# EAGLE board AllOfTheAbove7x14novTRIMS (EAGLE 9.5.1), part 1 of 2
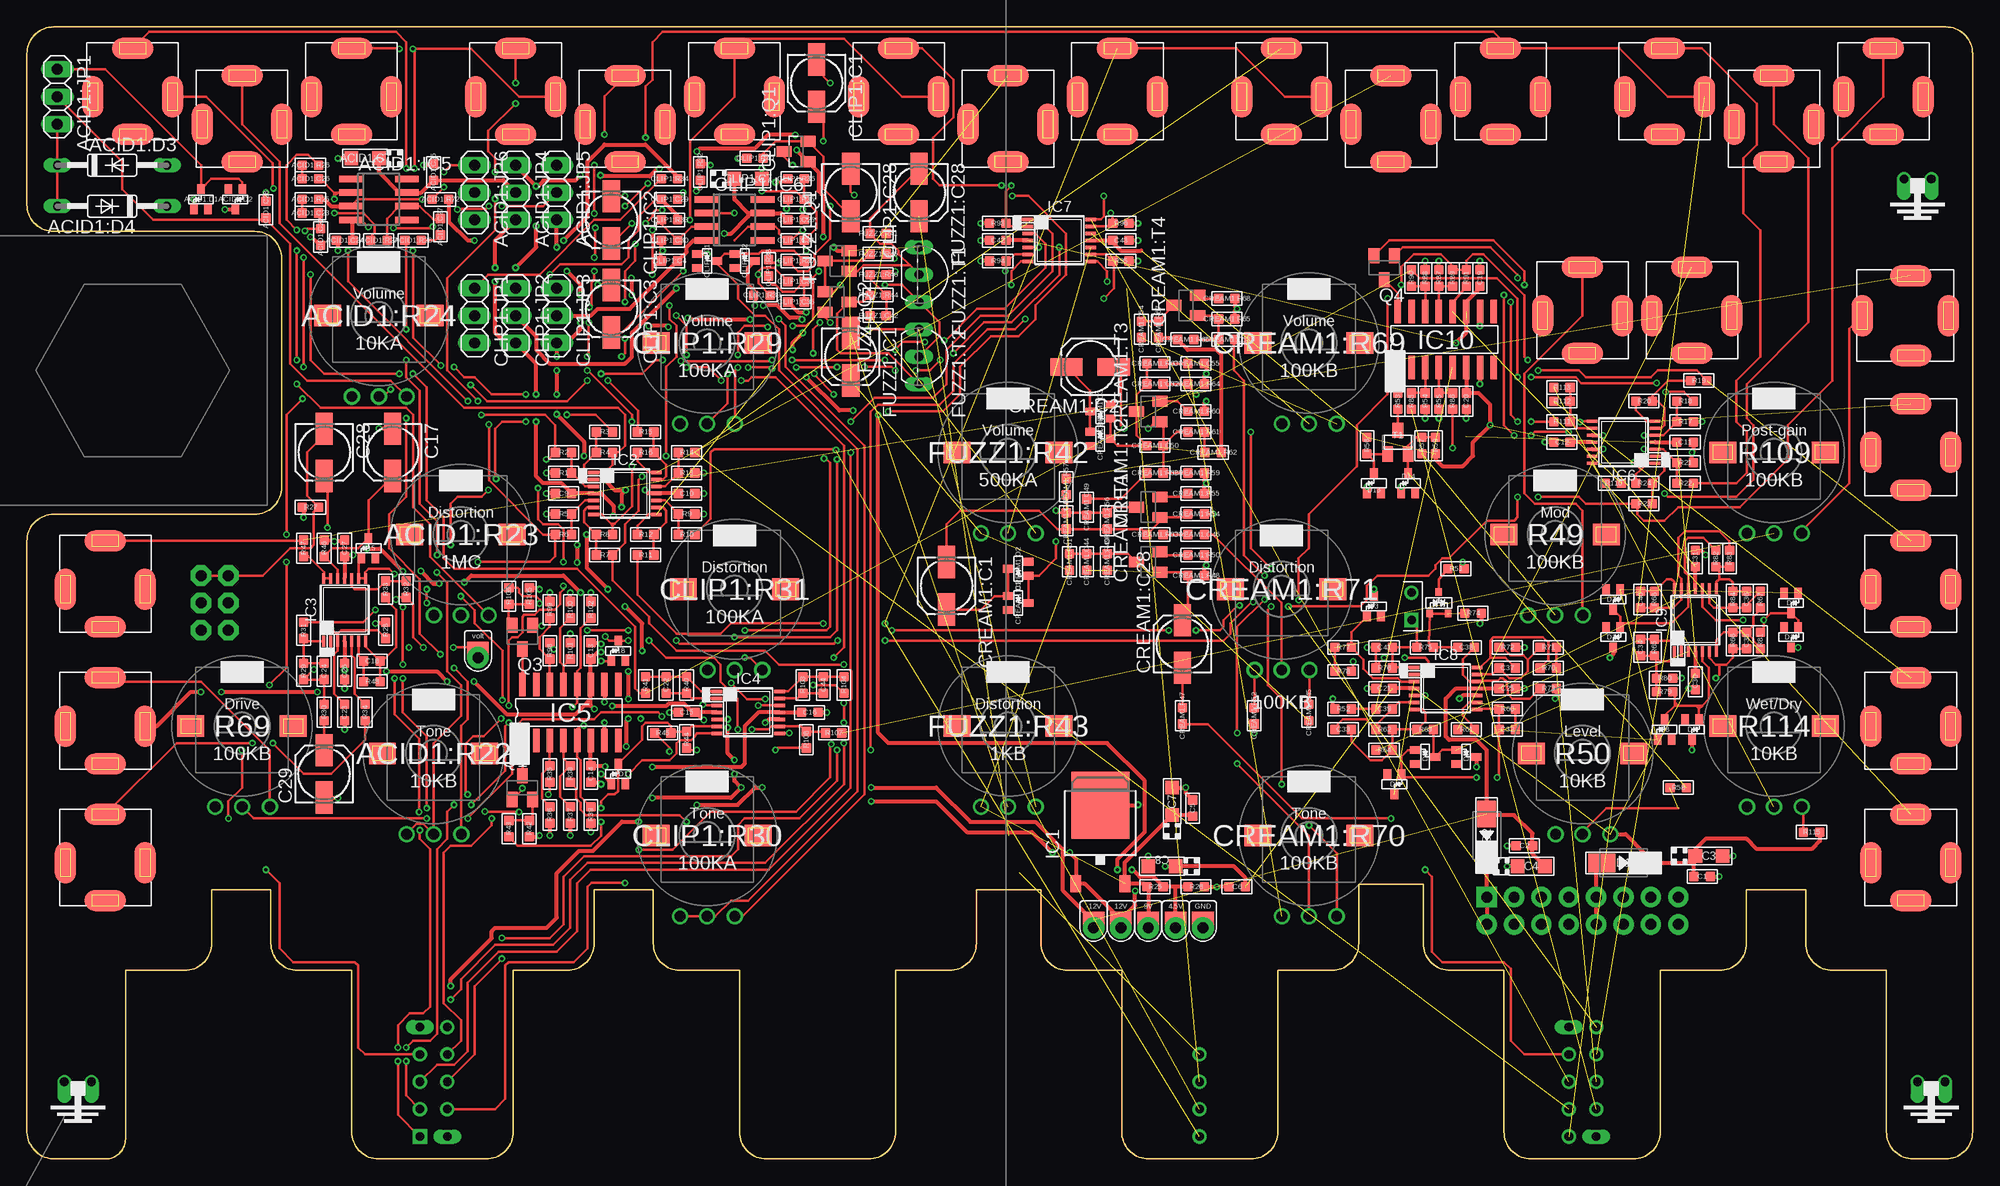
[diagram p10: board, top side]
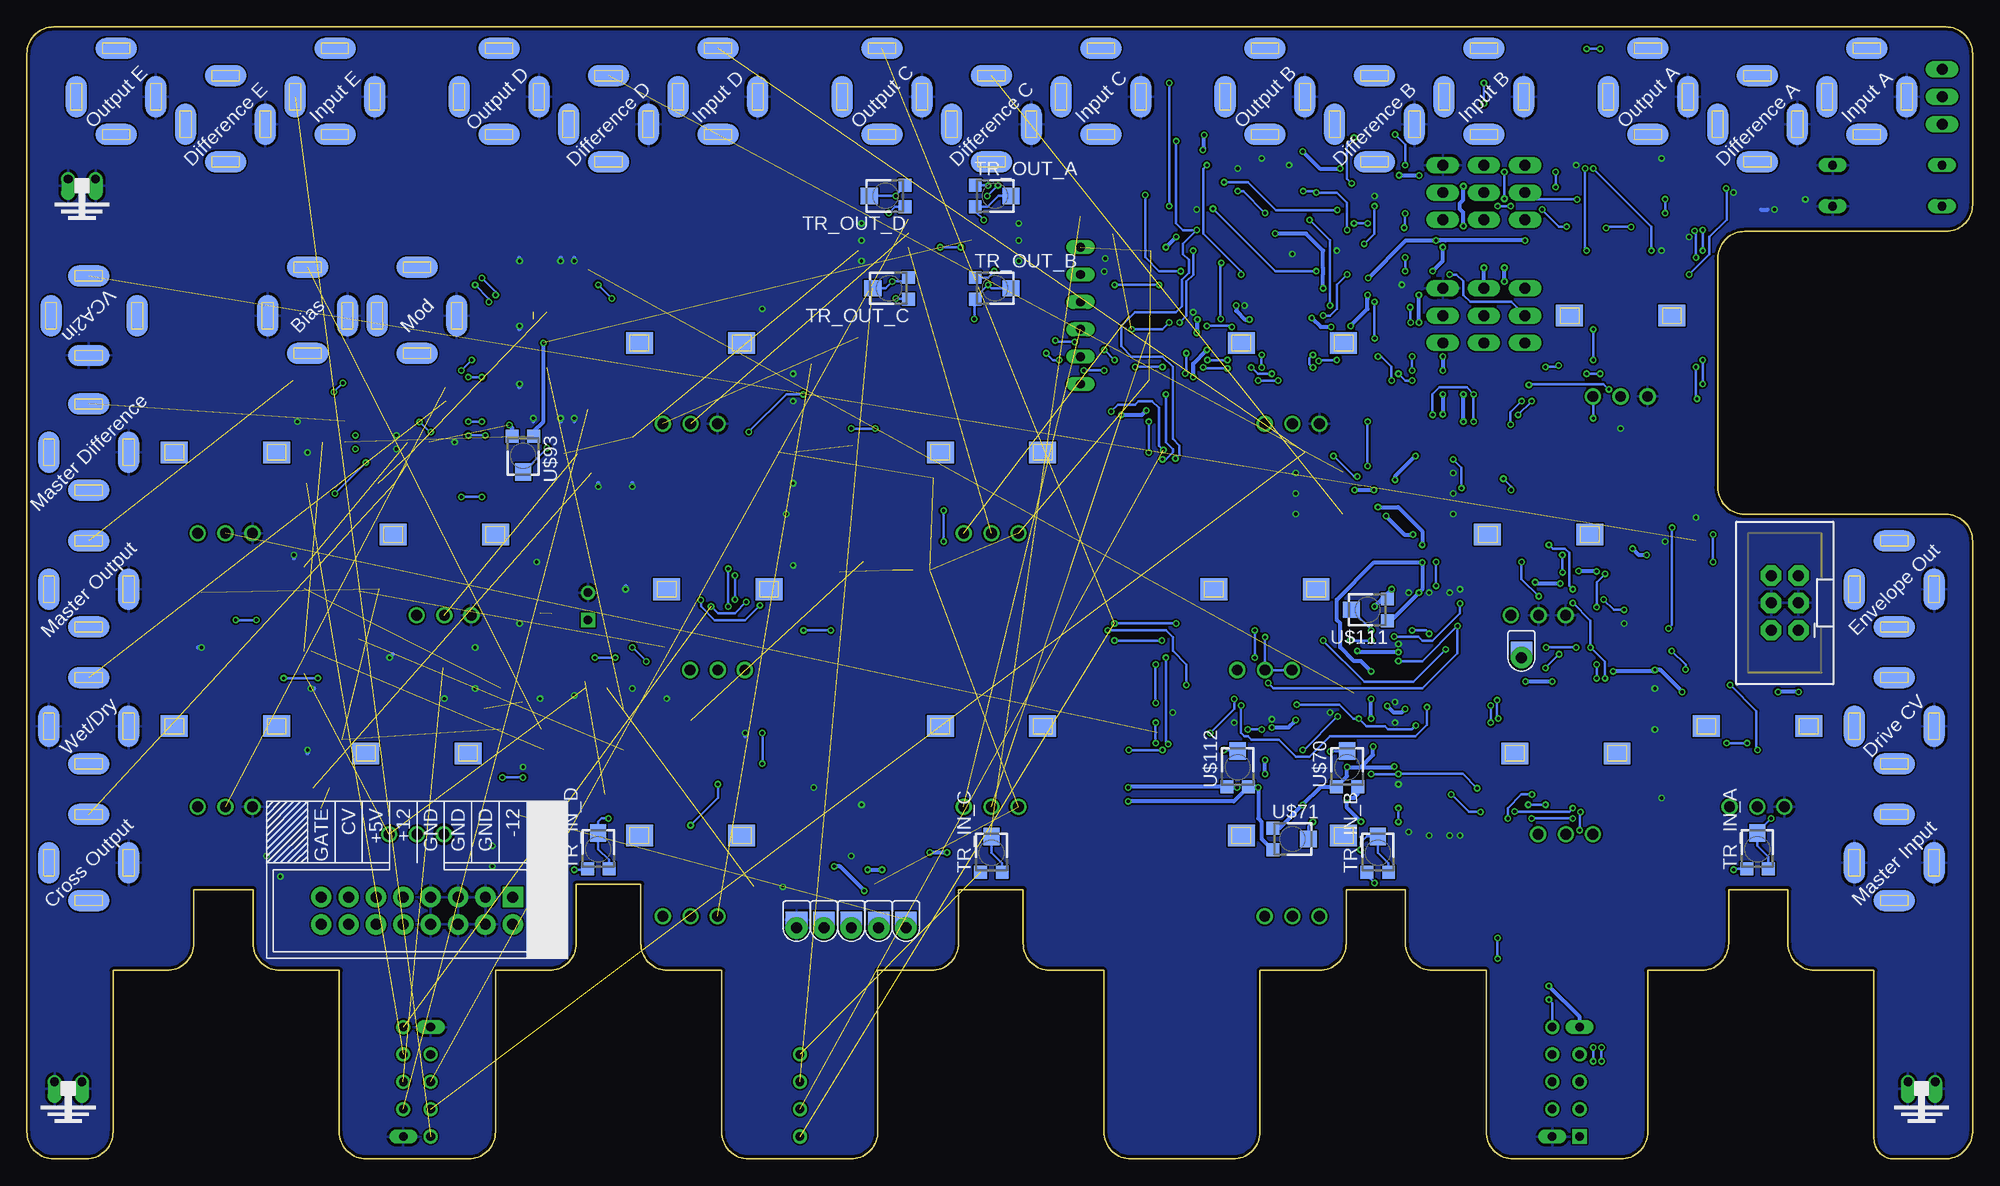
[diagram p11: board, bottom side, seen from below]

Size 180.66 x 105.08 mm. Coordinates in mm from the lower left corner, seen from the top.
Copper layers (1*16): Top 0.035mm / dielectric 1.5mm / Bottom 0.035mm
Design rules "ITeadstudio": minimum track width 6mil, minimum drill 12mil, track to track 6mil, track to pad 6mil, pad to pad 6mil, via to via 6mil, smd to smd 0mil, copper to edge 10mil, drill to drill 10mil, minimum pad ring 10mil, minimum via ring 6mil, stop-mask expansion 2mil, vias tented up to drill 100mil, thermal gap 10mil
Net classes: 0 default: width 0.254 mm; 1 power: width 0.381 mm

## Footprints (pad centres in the part's own frame; a part is rotated, then mirrored left to right if it is on the bottom)
CASE-A_3216 = smd 1.27 x 1.27: + -1.27,0; - 1.27,0
C0603 = smd 0.889 x 0.889: 1 -0.762,0; 2 0.762,0
SOT-323 = smd 0.7 x 0.9: ANODE -0.65,-0.95; CATHODE 0,0.95; NC 0.65,-0.95
DO35-10 = drill 0.813 long: A 5.08,0; C -5.08,0
SO08 = smd 0.6 x 2.2: 1 -1.905,-2.6; 2 -0.635,-2.6; 3 0.635,-2.6; 4 1.905,-2.6; 5 1.905,2.6; 6 0.635,2.6; 7 -0.635,2.6; 8 -1.905,2.6
1X03 = drill 1.016 long: 1 -2.54,0; 2 0,0; 3 2.54,0
ALPS_POT_SQUAREHOLES = drill 1: P$1 -2.5,-7.5; P$2 0,-7.5; P$3 2.58,-7.5 | smd 2.5 x 2: P$4 -4.75,0; P$5 4.75,0 | smd 2.5 x 2 bottom: P$6 -4.75,0; P$7 4.75,0
R0603 = smd 0.889 x 0.889: 1 -0.762,0; 2 0.762,0
153CLV-0505 = smd 3 x 1.6: + 2.2,0; - -2.2,0
SOT23 = smd 1 x 1.4: 1 -0.95,-1.1; 2 0.95,-1.1; 3 0,1.1
SOT23-BEC = smd 1 x 1.4: B -0.95,-1.1; C 0,1.1; E 0.95,-1.1
DO-214AC = smd 2.5 x 1.7: 1 -2,0; 2 2,0
TO92-EBC = drill 0.813 long: B 0,-1.27; C 2.54,-1.27; E -2.54,-1.27
TO252 = smd 1 x 1.6: 1 -2.28,-4.8; 2 2.28,-4.8 | smd 5.4 x 6.2: 3 0,2.5
TSSOP14 = smd 0.305 x 0.991: 1 -1.95,-2.918; 2 -1.3,-2.918; 3 -0.65,-2.918; 4 0,-2.918; 5 0.65,-2.918; 6 1.3,-2.918; 7 1.95,-2.918; 8 1.95,2.918; 9 1.3,2.918; 10 0.65,2.918; 11 0,2.918; 12 -0.65,2.918; 13 -1.3,2.918; 14 -1.95,2.918
SO16 = smd 0.6 x 2.2: 1 -4.445,-2.6; 2 -3.175,-2.6; 3 -1.905,-2.6; 4 -0.635,-2.6; 5 0.635,-2.6; 6 1.905,-2.6; 7 3.175,-2.6; 8 4.445,-2.6; 9 4.445,2.6; 10 3.175,2.6; 11 1.905,2.6; 12 0.635,2.6; 13 -0.635,2.6; 14 -1.905,2.6; 15 -3.175,2.6; 16 -4.445,2.6
3.5MM-JACK-SWITCH-13MM-NOHOLES = smd 1.95 x 3.85 bottom: RING_B@1 -3.7,0; SWITCH_B@1 3.7,0 | smd 1.95 x 3.85: RING_T@3 -3.7,0; SWITCH_T@3 3.7,0 | smd 3.85 x 1.95 bottom: SECOND_B@1 0,-3.5; TIP_B@1 0,4.5 | smd 3.85 x 1.95: SECOND_T@3 0,-3.5; TIP_T@3 0,4.5
POWER_16_SHROUDED = drill 1.016 pad 1.88 square: 1 -8.89,-1.27 | drill 1.016 pad 1.88: 2 -8.89,1.27; 3 -6.35,-1.27; 4 -6.35,1.27; 5 -3.81,-1.27; 6 -3.81,1.27; 7 -1.27,-1.27; 8 -1.27,1.27; 9 1.27,-1.27; 10 1.27,1.27; 11 3.81,-1.27; 12 3.81,1.27; 13 6.35,-1.27; 14 6.35,1.27; 15 8.89,-1.27; 16 8.89,1.27
TC33X = smd 1.2 x 1.2: 1 -1,-1.825; 3 1,-1.825 | smd 1.5 x 1.6: 2 0,1.5
POWERTESTPAD = drill 1 pad 2: P$1 0,0 | smd 2 x 1.5: P$2 0,-0.75 | smd 2 x 1.5 bottom: P$3 0,-0.75
BYPASSBOARD = drill 0.8 long: 12V 31.75,15.24; GND 34.29,5.08; GND2 138.43,15.24; GND3 140.97,5.08 | drill 0.8 square: P$1 31.75,5.08 | drill 0.8: P$2 31.75,10.16; P$3 31.75,7.62; P$4 31.75,12.7; P$5 34.29,15.24; P$6 34.29,10.16; P$7 34.29,12.7; P$8 34.29,7.62; P$9 104.14,5.08; P$10 104.14,10.16; P$11 104.14,7.62; P$12 104.14,12.7; P$13 138.43,5.08; P$14 138.43,10.16; P$15 138.43,7.62; P$16 138.43,12.7; P$17 140.97,15.24; P$18 140.97,10.16; P$19 140.97,12.7; P$20 140.97,7.62
GROUNDLOOP = drill 0.8 offset: P$1 1.27,0; P$2 -1.27,0
2X3-SHROUDED = drill 1.016 pad 1.88 octagon: 1 -1.27,2.54; 2 1.27,2.54; 3 -1.27,0; 4 1.27,0; 5 -1.27,-2.54; 6 1.27,-2.54
SOT23' = smd 0.6 x 0.7: P$1 -0.85,-1; P$2 0.85,-1; P$3 0,1
TESTPAD_DUAL_PTH = drill 0.8 square: P$1 -1.27,0 | drill 0.8: P$2 1.27,0

## Placement (x,y rotation side)
ACID1:C7  10uF  [CASE-A_3216]  31.41,92.89 180 top
ACID1:C22  1nF  [C0603]  27.28,85.58 270 top
ACID1:C23  10nF  [C0603]  26.33,87.81 180 top
ACID1:C24  100n  [C0603]  29.5,85.27 180 top
ACID1:C25  100n  [C0603]  37.76,91.61 90 top
ACID1:C26  47nF  [C0603]  26.33,90.98 0 top
ACID1:C27  1uF  [C0603]  38.39,86.53 270 top
ACID1:C28  1nF  [C0603]  22.2,88.12 270 top
ACID1:D1  BAS16W  [SOT-323]  16.17,89.08 0 top
ACID1:D2  BAS16W  [SOT-323]  19.34,89.08 180 top
ACID1:D3  1N4148DO35-10  [DO35-10]  7.91,92.25 0 top
ACID1:D4  1N4148DO35-10  [DO35-10]  7.91,88.44 180 top
ACID1:IC5  UA741D  [SO08]  32.68,89.08 270 top
ACID1:JP1  GERMANIUMSELECTOR  [1X03]  2.83,98.6 270 top
ACID1:JP4  ACID+  [1X03]  45.38,89.71 270 top
ACID1:JP5  ACID-  [1X03]  49.19,89.71 270 top
ACID1:JP6  ACIDBIAS  [1X03]  41.57,89.71 270 top
ACID1:R22  10KB  [ALPS_POT_SQUAREHOLES]  37.76,37.64 0 top
ACID1:R23  1MC  [ALPS_POT_SQUAREHOLES]  40.3,57.96 0 top
ACID1:R24  10KA  [ALPS_POT_SQUAREHOLES]  32.68,78.28 0 top
ACID1:R25  10K  [R0603]  26.33,89.08 180 top
ACID1:R26  4.7K  [R0603]  26.33,92.25 0 top
ACID1:R27  1M  [R0603]  32.68,85.27 0 top
ACID1:R28  5.6K  [R0603]  35.85,85.27 0 top
ACID1:R72  1M  [R0603]  38.39,89.08 0 top
C1  100n  [C0603]  155.55,26.21 180 top
C2  100n  [C0603]  139.04,29.07 180 top
C3  10u  [CASE-A_3216]  156.18,28.11 0 top
C4  10u  [CASE-A_3216]  139.67,27.16 0 top
C5  100n  [C0603]  108.24,32.56 270 top
C6  100n  [C0603]  112.37,25.26 0 top
C7  10u  [CASE-A_3216]  106.34,33.2 90 top
C8  10u  [CASE-A_3216]  105.38,27.16 180 top
C9  100n  [C0603]  49.82,61.77 0 top
C10  100n  [C0603]  61.25,61.77 0 top
C11  100n  [C0603]  153.96,66.53 180 top
C12  100n  [C0603]  142.53,66.53 180 top
C13  100n  [C0603]  52.36,47.16 270 top
C14  100n  [C0603]  52.36,35.73 270 top
C15  100n  [C0603]  61.25,41.45 0 top
C16  100n  [C0603]  72.68,41.45 0 top
C17  10uF  [153CLV-0505]  33.95,65.58 270 top
C18  10pF  [C0603]  32.04,46.21 0 top
C19  100n  [C0603]  134.91,81.77 270 top
C20  100n  [C0603]  133.64,70.34 270 top
C21  100n  [C0603]  126.02,43.67 0 top
C22  10pF  [C0603]  59.35,43.99 90 top
C23  10pF  [C0603]  29.5,41.45 90 top
C24  47pF  [C0603]  27.6,45.26 270 top
C25  100n  [C0603]  137.45,43.67 0 top
C26  100n  [C0603]  29.5,45.26 90 top
C27  100n  [C0603]  29.5,56.69 90 top
C28  10uF  [153CLV-0505]  27.6,65.58 270 top
C29  10uF  [153CLV-0505]  27.6,35.73 90 top
C30  100n  [C0603]  154.91,44.31 90 top
C31  100n  [C0603]  154.91,55.74 90 top
C32  33p  [C0603]  137.45,39.86 0 top
C33  220p  [C0603]  122.21,39.86 180 top
C34  33p  [C0603]  149.83,47.48 90 top
C35  33p  [C0603]  159.68,48.12 270 top
C36  33p  [C0603]  159.68,51.93 270 top
C37  33p  [C0603]  137.45,45.58 180 top
C38  100n  [C0603]  133.64,47.48 180 top
C39  680n  [C0603]  126.02,41.77 0 top
C40  33p FIX  [C0603]  149.83,51.93 270 top
C41  33p FIX  [C0603]  126.02,47.48 180 top
C42  100n  [C0603]  90.14,85.27 0 top
C43  100n  [C0603]  101.57,85.27 0 top
C44  10pF  [C0603]  73.95,43.99 90 top
CLIP1:C1  4.7uF  [153CLV-0505]  73.32,99.87 270 top
CLIP1:C2  2.2uF  [153CLV-0505]  54.27,87.17 270 top
CLIP1:C3  4.7uF  [153CLV-0505]  54.27,78.92 270 top
CLIP1:C4  100n  [C0603]  59.66,83.36 180 top
CLIP1:C7  10uF  [CASE-A_3216]  66.97,90.98 0 top
CLIP1:C25  100n  [C0603]  71.41,87.17 0 top
CLIP1:C28  1uF  [153CLV-0505]  76.49,89.71 270 top
CLIP1:C29  22nF  [C0603]  59.66,89.08 180 top
CLIP1:C30  1nF  [C0603]  59.66,85.27 0 top
CLIP1:C31  100pF  [C0603]  71.41,85.27 180 top
CLIP1:C35  3.3nF  [C0603]  71.41,79.55 180 top
CLIP1:C36  22nF  [C0603]  71.41,81.45 180 top
CLIP1:D1  BAS16W  [SOT-323]  63.16,83.36 270 top
CLIP1:D2  BAS16W  [SOT-323]  66.65,83.36 270 top
CLIP1:IC6  UA741D  [SO08]  65.7,87.17 270 top
CLIP1:JP1  CLIPBIAS  [1X03]  41.57,78.28 270 top
CLIP1:JP2  CLIP+  [1X03]  45.38,78.28 270 top
CLIP1:JP3  CLIP-  [1X03]  49.19,78.28 270 top
CLIP1:Q1  SST201  [SOT23]  71.41,93.52 90 top
CLIP1:R29  100KA  [ALPS_POT_SQUAREHOLES]  63.16,75.74 0 top
CLIP1:R30  100KA  [ALPS_POT_SQUAREHOLES]  63.16,30.02 0 top
CLIP1:R31  100KA  [ALPS_POT_SQUAREHOLES]  65.7,52.88 0 top
CLIP1:R32  1M  [R0603]  62.52,91.61 90 top
CLIP1:R33  1K  [R0603]  59.66,87.17 180 top
CLIP1:R34  1M  [R0603]  59.66,90.98 0 top
CLIP1:R35  560R  [R0603]  71.41,89.08 0 top
CLIP1:R36  47R  [R0603]  71.41,90.98 0 top
CLIP1:R37  1K  [R0603]  71.41,83.36 0 top
CLIP1:R38  1.5K  [R0603]  68.87,82.72 270 top
CLIP1:R39  1M  [R0603]  68.24,80.19 0 top
CLIP1:R40  10K  [R0603]  67.6,92.89 0 top
CREAM1:C1  1uF  [153CLV-0505]  85.38,53.2 270 top
CREAM1:C2  1uF  [153CLV-0505]  98.72,73.52 180 top
CREAM1:C28  1uF  [153CLV-0505]  107.29,47.8 90 top
CREAM1:C44  470pF  [C0603]  98.4,55.42 90 top
CREAM1:C45  1uF  [C0603]  119.04,41.45 90 top
CREAM1:C46  100nF  [C0603]  108.56,57.96 180 top
CREAM1:C47  470pF  [C0603]  96.49,59.23 90 top
CREAM1:C49  100nF  [C0603]  98.4,60.5 90 top
CREAM1:C50  470pF  [C0603]  104.75,66.22 180 top
CREAM1:C52  4nF  [C0603]  104.75,71.93 0 top
CREAM1:C53  100nF  [C0603]  111.42,76.06 180 top
CREAM1:C54  100nF  [C0603]  103.48,77.01 270 top
CREAM1:C55  10nF  [C0603]  108.56,73.83 180 top
CREAM1:D1  BAS16W  [SOT-323]  92.05,51.61 270 top
CREAM1:D2  BAS16W  [SOT-323]  92.05,54.78 90 top
CREAM1:D3  BAS16W  [SOT-323]  99.67,69.39 90 top
CREAM1:D4  BAS16W  [SOT-323]  99.67,66.85 270 top
CREAM1:R47  39K  [R0603]  107.29,41.13 90 top
CREAM1:R48  47K  [R0603]  108.56,54.15 180 top
CREAM1:R49  470K  [R0603]  100.3,55.42 270 top
CREAM1:R50  100R  [R0603]  108.56,56.05 0 top
CREAM1:R51  10K  [R0603]  96.81,55.42 90 top
CREAM1:R52  1K  [R0603]  113.96,41.13 270 top
CREAM1:R53  10K  [R0603]  104.75,57.96 180 top
CREAM1:R54  100K  [R0603]  108.56,59.87 180 top
CREAM1:R55  150R  [R0603]  108.56,61.77 180 top
CREAM1:R56  470K  [R0603]  100.3,59.23 270 top
CREAM1:R57  10K  [R0603]  96.49,62.41 270 top
CREAM1:R58  10K  [R0603]  104.75,63.67 0 top
CREAM1:R59  100K  [R0603]  108.56,63.67 180 top
CREAM1:R60  150R  [R0603]  108.56,69.39 180 top
CREAM1:R61  470K  [R0603]  108.56,67.48 180 top
CREAM1:R62  10K  [R0603]  110.15,65.58 180 top
CREAM1:R63  39K  [R0603]  104.75,73.83 0 top
CREAM1:R64  22K  [R0603]  108.56,71.93 0 top
CREAM1:R65  100K  [R0603]  111.42,77.96 180 top
CREAM1:R66  430K  [R0603]  107.61,76.06 180 top
CREAM1:R67  15K  [R0603]  105.07,77.01 270 top
CREAM1:R68  3.3K  [R0603]  111.42,79.87 180 top
CREAM1:R69  100KB  [ALPS_POT_SQUAREHOLES]  119.04,75.74 0 top
CREAM1:R70  100KB  [ALPS_POT_SQUAREHOLES]  119.04,30.02 0 top
CREAM1:R71  100KB  [ALPS_POT_SQUAREHOLES]  116.5,52.88 0 top
CREAM1:T1  2n3904  [SOT23-BEC]  104.11,55.42 90 top
CREAM1:T2  2n3904  [SOT23-BEC]  104.11,60.5 90 top
CREAM1:T3  2n3904  [SOT23-BEC]  104.11,69.39 90 top
CREAM1:T4  2n3904  [SOT23-BEC]  107.61,79.23 90 top
D1  1n4001  [DO-214AC]  148.25,27.48 0 top
D2  1n4001  [DO-214AC]  135.55,30.02 270 top
D3  BAS16W  [SOT-323]  125.07,51.29 0 top
D4  BAS16W  [SOT-323]  126.97,34.78 180 top
D5  BAS16W  [SOT-323]  133.64,37.32 270 top
D6  BAS16W  [SOT-323]  129.83,37.32 270 top
D7  BAS16W  [SOT-323]  154.6,39.86 180 top
D8  BAS16W  [SOT-323]  152.06,39.86 0 top
D9  BAS16W  [SOT-323]  163.8,51.61 180 top
D10  BAS16W  [SOT-323]  147.29,51.93 180 top
D11  BAS16W  [SOT-323]  147.29,48.44 180 top
D12  BAS16W  [SOT-323]  163.8,48.44 180 top
D13  BAS16W  [SOT-323]  125.07,62.72 0 top
D14  BAS16W  [SOT-323]  128.24,62.72 0 top
D15  BAS16W  [SOT-323]  31.72,56.69 0 top
D17  BAS16W  [SOT-323]  54.9,35.73 0 top
D18  BAS16W  [SOT-323]  54.9,47.16 0 top
FUZZ1:C1  20uF  [153CLV-0505]  76.49,74.47 270 top
FUZZ1:C28  2.2uF  [153CLV-0505]  82.84,89.71 270 top
FUZZ1:C42  10nF  [C0603]  79.03,78.28 180 top
FUZZ1:Q1  MMBT3906LT1SMD  [SOT23-BEC]  75.22,83.36 90 top
FUZZ1:Q2  MMBT3906LT1SMD  [SOT23-BEC]  75.22,79.55 270 top
FUZZ1:R41  100K  [R0603]  79.03,85.9 180 top
FUZZ1:R42  500KA  [ALPS_POT_SQUAREHOLES]  91.1,65.58 0 top
FUZZ1:R43  1KB  [ALPS_POT_SQUAREHOLES]  91.1,40.18 0 top
FUZZ1:R44  8.2K  [R0603]  79.03,80.19 180 top
FUZZ1:R45  33K  [R0603]  79.03,84 180 top
FUZZ1:R46  470R  [R0603]  79.03,82.09 180 top
FUZZ1:T1  [TO92-EBC]  84.11,82.09 270 top
FUZZ1:T2  [TO92-EBC]  84.11,74.47 270 top
IC1  7809DT  [TO252]  99.67,30.34 0 top
IC2  TL074TSSOP14  [TSSOP14]  55.54,61.77 270 top
IC3  TL074TSSOP14  [TSSOP14]  29.5,50.98 0 top
IC4  TL074TSSOP14  [TSSOP14]  66.97,41.45 270 top
IC5  LM13700M  [SO16]  50.46,41.45 0 top
IC6  TL074TSSOP14  [TSSOP14]  148.25,66.53 90 top
IC7  TL074TSSOP14  [TSSOP14]  95.86,85.27 270 top
IC8  TL074TSSOP14  [TSSOP14]  131.74,43.67 270 top
IC9  TL074TSSOP14  [TSSOP14]  154.91,50.02 0 top
IC10  LM13700M  [SO16]  131.74,76.06 0 top
J1  JACK  [3.5MM-JACK-SWITCH-13MM-NOHOLES]  174.92,78.28 90 top
J2  POWERSHROUDED  [POWER_16_SHROUDED]  144.44,23.04 180 bottom
J3  JACK  [3.5MM-JACK-SWITCH-13MM-NOHOLES]  174.92,52.88 0 top
J4  JACK  [3.5MM-JACK-SWITCH-13MM-NOHOLES]  45.38,98.6 0 top
J5  JACK  [3.5MM-JACK-SWITCH-13MM-NOHOLES]  55.54,96.06 0 top
J6  JACK  [3.5MM-JACK-SWITCH-13MM-NOHOLES]  9.82,98.6 0 top
J7  JACK  [3.5MM-JACK-SWITCH-13MM-NOHOLES]  30.14,98.6 0 top
J8  JACK  [3.5MM-JACK-SWITCH-13MM-NOHOLES]  19.98,96.06 0 top
J9  JACK  [3.5MM-JACK-SWITCH-13MM-NOHOLES]  65.7,98.6 0 top
J10  JACK  [3.5MM-JACK-SWITCH-13MM-NOHOLES]  174.92,65.58 0 top
J11  JACK  [3.5MM-JACK-SWITCH-13MM-NOHOLES]  80.94,98.6 0 top
J12  JACK  [3.5MM-JACK-SWITCH-13MM-NOHOLES]  91.1,96.06 0 top
J13  JACK  [3.5MM-JACK-SWITCH-13MM-NOHOLES]  101.26,98.6 0 top
J14  JACK  [3.5MM-JACK-SWITCH-13MM-NOHOLES]  116.5,98.6 0 top
J15  JACK  [3.5MM-JACK-SWITCH-13MM-NOHOLES]  126.66,96.06 0 top
J16  JACK  [3.5MM-JACK-SWITCH-13MM-NOHOLES]  136.82,98.6 0 top
J17  JACK  [3.5MM-JACK-SWITCH-13MM-NOHOLES]  152.06,98.6 0 top
J18  JACK  [3.5MM-JACK-SWITCH-13MM-NOHOLES]  162.22,96.06 0 top
J19  JACK  [3.5MM-JACK-SWITCH-13MM-NOHOLES]  172.38,98.6 0 top
J20  JACK  [3.5MM-JACK-SWITCH-13MM-NOHOLES]  7.28,27.48 0 top
J21  JACK  [3.5MM-JACK-SWITCH-13MM-NOHOLES]  7.28,40.18 0 top
J22  JACK  [3.5MM-JACK-SWITCH-13MM-NOHOLES]  144.44,78.28 0 top
J23  JACK  [3.5MM-JACK-SWITCH-13MM-NOHOLES]  154.6,78.28 0 top
J24  JACK  [3.5MM-JACK-SWITCH-13MM-NOHOLES]  7.28,52.88 0 top
J25  JACK  [3.5MM-JACK-SWITCH-13MM-NOHOLES]  174.92,40.18 0 top
J26  JACK  [3.5MM-JACK-SWITCH-13MM-NOHOLES]  174.92,27.48 0 top
PCB1  EURORACK_PCB5STOMP  [EURORACK36HP_5STOMP]  -0.34,-3 0 top
Q1  MMBT3906LT1SMD  [SOT23-BEC]  46.01,34.47 0 top
Q3  MMBT3906LT1SMD  [SOT23-BEC]  46.01,48.44 180 top
Q4  MMBT3906LT1SMD  [SOT23-BEC]  126.02,82.72 180 top
R1  100k  [R0603]  49.82,63.67 180 top
R2  100k  [R0603]  49.82,65.58 180 top
R3  100k  [R0603]  53.63,67.48 0 top
R4  100k  [R0603]  53.63,65.58 180 top
R5  100k  [R0603]  49.82,59.87 180 top
R6  100k  [R0603]  49.82,57.96 180 top
R7  100k  [R0603]  53.63,56.05 0 top
R8  100k  [R0603]  53.63,57.96 180 top
R9  100k  [R0603]  61.25,59.87 0 top
R10  100k  [R0603]  61.25,57.96 0 top
R11  100k  [R0603]  57.44,56.05 180 top
R12  100k  [R0603]  57.44,57.96 0 top
R13  100k  [R0603]  61.25,63.67 0 top
R14  100k  [R0603]  61.25,65.58 0 top
R15  100k  [R0603]  57.44,67.48 180 top
R16  100k  [R0603]  57.44,65.58 0 top
R17  100k  [R0603]  153.96,68.44 0 top
R18  100k  [R0603]  153.96,70.34 0 top
R19  100k  [R0603]  155.23,72.25 0 top
R20  100k  [R0603]  150.15,70.34 0 top
R21  100k  [R0603]  153.96,64.63 0 top
R22  100k  [R0603]  153.96,62.72 0 top
R23  100k  [R0603]  150.15,60.82 180 top
R24  100k  [R0603]  150.15,62.72 0 top
R25  100k  [R0603]  104.75,25.26 180 top
R26  100k  [R0603]  108.56,25.26 180 top
R27  1M  [R0603]  26.33,60.5 0 top
R28  150K  [R0603]  33.31,49.07 270 top
R29  10K  [R0603]  25.69,45.26 90 top
R30  470R  [R0603]  27.6,41.45 90 top
R31  1K  [R0603]  25.69,49.07 90 top
R32  100K  [R0603]  35.22,52.88 270 top
R33  100K  [R0603]  33.31,52.88 270 top
R34  100k  [R0603]  31.41,41.45 90 top
R35  4.7K  [R0603]  48.55,35.73 90 top
R36  10R  [R0603]  48.55,31.92 90 top
R37  10R  [R0603]  50.46,31.92 270 top
R38  100K  [R0603]  50.46,35.73 270 top
R39  100K  [R0603]  52.36,31.92 270 top
R40  100K  [R0603]  61.25,43.99 90 top
R41  1K  [R0603]  57.44,43.99 270 top
R42  10K  [R0603]  46.65,30.66 90 top
R43  100K  [R0603]  44.74,30.66 90 top
R44  100K  [R0603]  61.25,38.91 90 top
R45  330K  [R0603]  59.03,39.55 0 top
R46  330K  [R0603]  27.6,56.69 270 top
R47  1K  [R0603]  25.69,56.69 270 top
R48  100k  [R0603]  32.04,44.31 0 top
R49  100KB  [ALPS_POT_SQUAREHOLES]  141.9,57.96 0 top
R50  10KB  [ALPS_POT_SQUAREHOLES]  144.44,37.64 0 top
R51  14  [R0603]  132.69,54.78 0 top
R52  470K  [R0603]  122.21,41.77 180 top
R53  4K7  [R0603]  127.29,70.34 90 top
R54  100  [R0603]  129.83,70.34 90 top
R55  100  [R0603]  131.1,70.34 90 top
R56  470K  [R0603]  124.43,66.22 90 top
R57  22K  [R0603]  129.51,66.22 270 top
R58  33K  [R0603]  153.33,34.47 180 top
R59  4M7  [R0603]  130.78,66.22 90 top
R60  10K  [R0603]  137.45,41.77 0 top
R61  47K  [R0603]  133.64,39.86 180 top
R62  33K  [R0603]  126.02,39.86 180 top
R63  33K  [R0603]  129.83,39.86 180 top
R64  100K  [R0603]  126.02,37.96 0 top
R65  100K  [R0603]  151.1,47.48 90 top
R66  100K  [R0603]  158.41,48.12 270 top
R67  100K  [R0603]  160.95,51.93 270 top
R68  100K  [R0603]  151.1,51.93 270 top
R69  100KB  [ALPS_POT_SQUAREHOLES]  19.98,40.18 0 top
R70  100  [R0603]  141.26,45.58 180 top
R71  100K  [R0603]  141.26,47.48 180 top
R72  10K  [R0603]  137.45,47.48 0 top
R73  220K  [R0603]  141.26,43.67 180 top
R74  10K  [R0603]  134.28,50.66 180 top
R75  6K8  [R0603]  129.83,47.48 0 top
R76  100K  [R0603]  126.02,45.58 0 top
R77  33K  [R0603]  122.21,47.48 0 top
R78  100K  [R0603]  122.21,45.26 0 top
R79  33K  [R0603]  152.06,43.35 180 top
R80  100K  [R0603]  152.06,44.62 180 top
R81  33K  [R0603]  160.95,48.12 270 top
R82  33K  [R0603]  156.82,55.74 270 top
R83  100K  [R0603]  158.09,55.74 270 top
R84  100K  [R0603]  158.41,51.93 270 top
R85  27k  [R0603]  128.56,70.34 270 top
R86  150k  [R0603]  132.37,70.34 270 top
R87  1k  [R0603]  131.1,81.77 270 top
R88  1k  [R0603]  129.83,81.77 270 top
R89  200k  [R0603]  132.37,81.77 90 top
R90  200k  [R0603]  128.56,81.77 90 top
R91  47k  [R0603]  133.64,81.77 270 top
R93  4.7k  [R0603]  90.14,86.85 180 top
R94  4.7k  [R0603]  90.14,83.36 180 top
R95  4.7k  [R0603]  101.57,83.36 0 top
R96  4.7k  [R0603]  101.57,86.85 0 top
R98  4.7K  [R0603]  48.55,47.16 270 top
R99  10R  [R0603]  48.55,50.98 270 top
R100  10R  [R0603]  50.46,50.98 90 top
R101  100K  [R0603]  50.46,47.16 90 top
R102  100K  [R0603]  52.36,50.98 90 top
R103  100K  [R0603]  72.05,43.99 90 top
R104  1K  [R0603]  75.86,43.99 270 top
R105  10K  [R0603]  46.65,52.24 270 top
R106  100K  [R0603]  44.74,52.24 270 top
R107  100K  [R0603]  74.9,39.55 180 top
R108  330K  [R0603]  72.36,38.91 90 top
R109  100KB  [ALPS_POT_SQUAREHOLES]  162.22,65.58 0 top
R110  47k  [R0603]  147.29,62.72 0 top
R111  2.2k  [R0603]  142.53,68.44 0 top
R112  18k  [R0603]  142.53,70.34 180 top
R113  18k  [R0603]  142.53,71.61 180 top
R114  10KB  [ALPS_POT_SQUAREHOLES]  162.22,40.18 0 top
R115  14k  [R0603]  165.71,30.34 180 top
T1  3906  [SOT23-BEC]  127.29,66.53 0 top
TR_IN_A  50k  [TC33X]  19.98,28.75 0 bottom
TR_IN_B  50k  [TC33X]  55.22,28.43 0 bottom
TR_IN_C  50k  [TC33X]  91.1,28.43 0 bottom
TR_IN_D  50k  [TC33X]  127.61,28.75 0 bottom
TR_OUT_A  50k  [TC33X]  90.78,89.39 270 bottom
TR_OUT_B  50k  [TC33X]  90.78,80.82 270 bottom
TR_OUT_C  50k  [TC33X]  100.62,80.82 90 bottom
TR_OUT_D  50k  [TC33X]  100.94,89.39 90 bottom
U$13  VOLTAGETESTPAD  [POWERTESTPAD]  101.57,21.45 180 top
U$15  VOLTAGETESTPAD  [POWERTESTPAD]  41.88,46.53 180 top
U$22  5STOMPBOARD  [BYPASSBOARD]  4.74,-3 0 top
U$23  HEADPHONEHOLE_BIGGAP  [HEADPHONEHOLE_GAP]  9.82,73.2 180 top
U$41  VOLTAGETESTPAD  [POWERTESTPAD]  99.03,21.45 180 top
U$42  VOLTAGETESTPAD  [POWERTESTPAD]  104.11,21.45 180 top
U$43  VOLTAGETESTPAD  [POWERTESTPAD]  109.19,21.45 180 top
U$44  VOLTAGETESTPAD  [POWERTESTPAD]  106.65,21.45 180 top
U$48  GNDLOOP  [GROUNDLOOP]  176.82,7.16 0 top
U$49  GNDLOOP  [GROUNDLOOP]  175.55,90.98 0 top
U$50  GNDLOOP  [GROUNDLOOP]  4.74,7.16 0 top
U$68  HEADPHONE  [2X3-SHROUDED]  17.44,51.61 180 bottom
U$70  100k  [TC33X]  58.08,36.37 0 bottom
U$71  100k  [TC33X]  63.16,29.7 270 bottom
U$74  BAT54S  [SOT23']  131.1,51.61 0 top
U$92  TESTPOINT_DUAL_PTH  [TESTPAD_DUAL_PTH]  128.56,51.29 90 top
U$93  50K  [TC33X]  134.59,65.26 180 bottom
U$111  100k  [TC33X]  56.17,50.98 90 bottom
U$112  100k  [TC33X]  68.24,36.37 0 bottom